# EAGLE design dash-board2 (EAGLE 4.16)
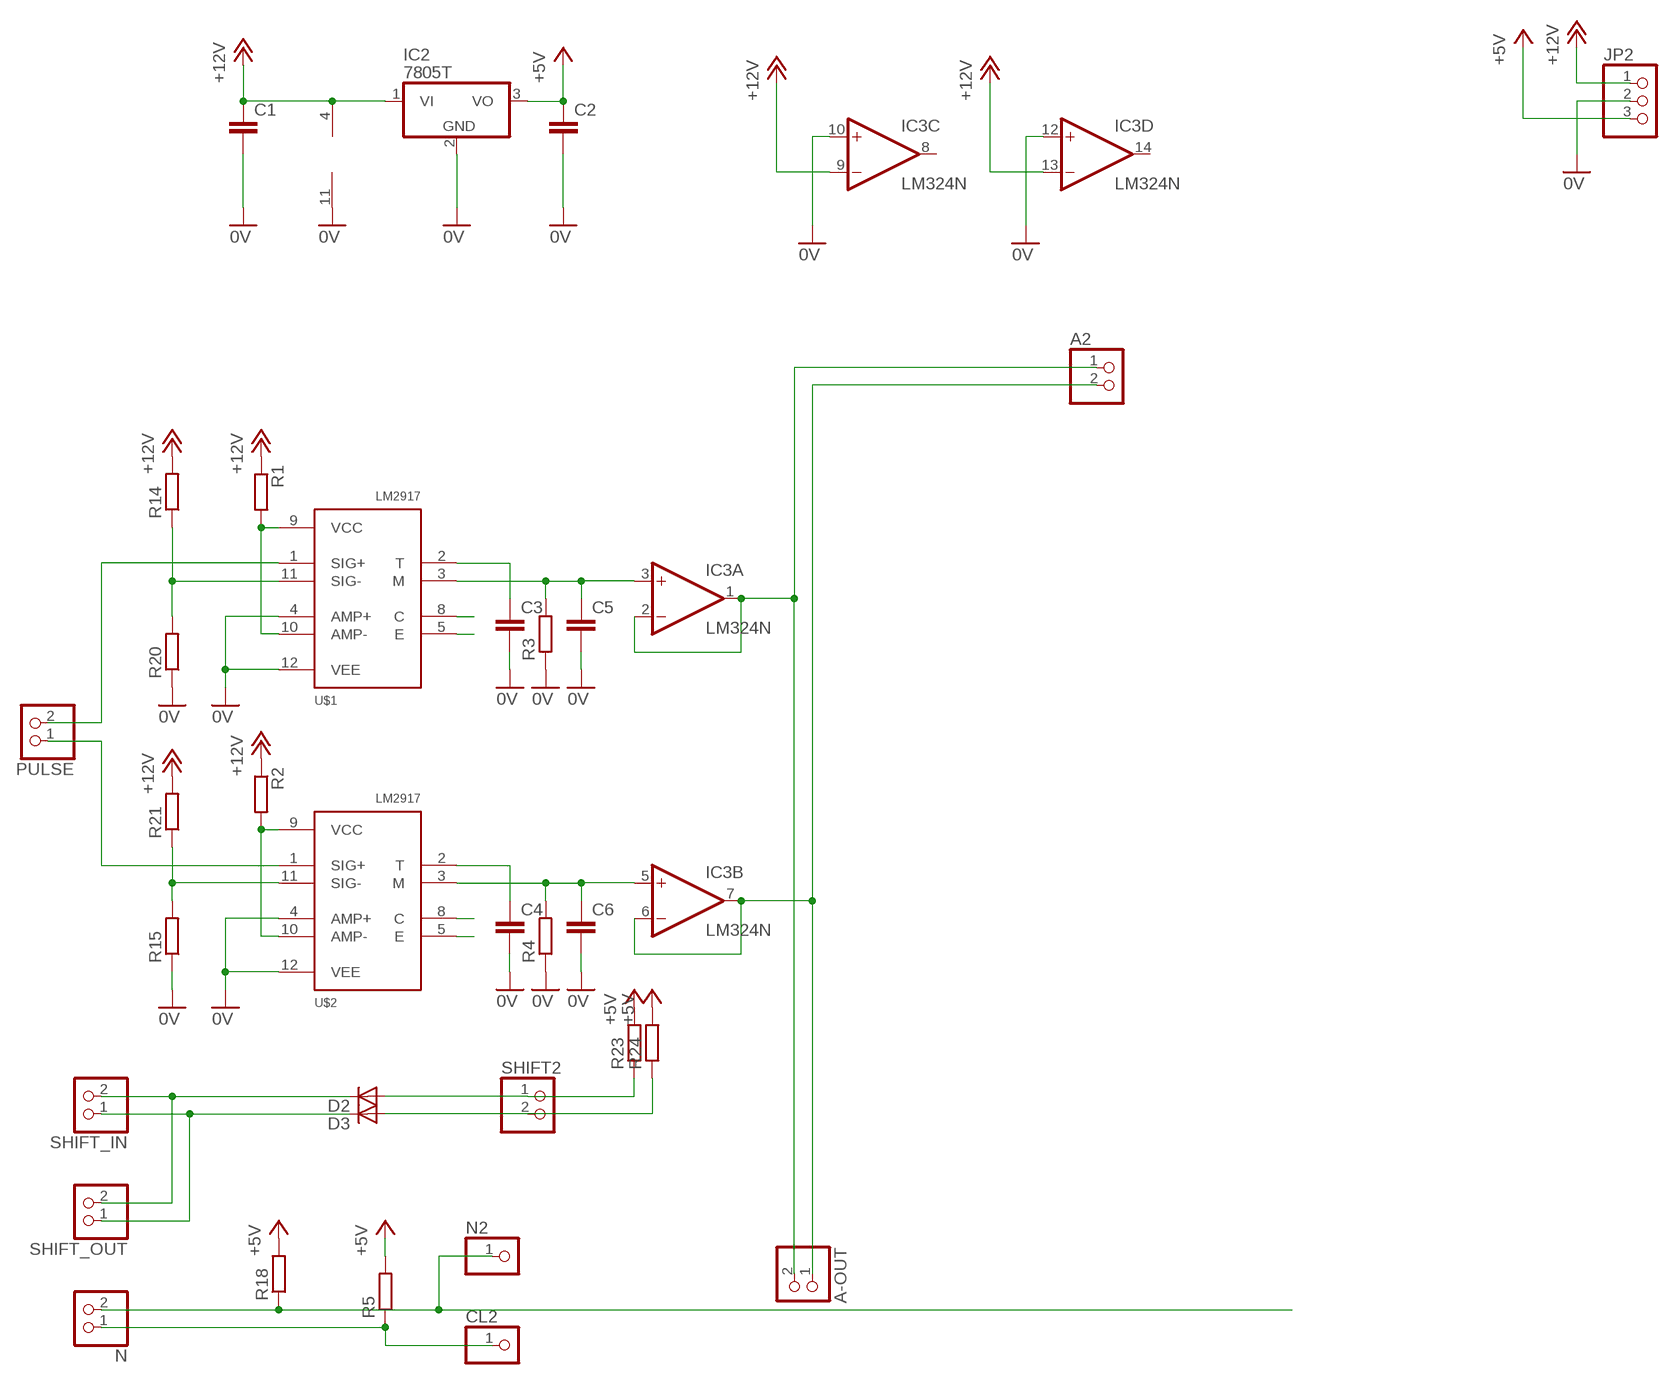
[diagram p0: schematic, sheet 1]

## Parts
A2  PINHD-1X2  [1X02]
A-OUT  PINHD-1X2  [1X02]
C1  C-EU050-025X075  [C050-025X075]
C2  C-EU050-025X075  [C050-025X075]
C3  C-EU050-025X075  [C050-025X075]
C4  C-EU050-025X075  [C050-025X075]
C5  C-EU050-025X075  [C050-025X075]
C6  C-EU050-025X075  [C050-025X075]
CL2  PINHD-1X1  [1X01]
D2  DIODE-D-7.5  [D-7.5]
D3  DIODE-D-7.5  [D-7.5]
IC2  7805T  [TO220H]
IC3  LM324N  [DIL14]
JP2  PINHD-1X3  [1X03]
N  PINHD-1X2  [1X02]
N2  PINHD-1X1  [1X01]
PULSE  PINHD-1X2  [1X02]
R1  R-EU_0204/7  [0204/7]
R2  R-EU_0204/7  [0204/7]
R3  R-EU_0204/7  [0204/7]
R4  R-EU_0204/7  [0204/7]
R5  R-EU_0204/7  [0204/7]
R14  R-EU_0204/7  [0204/7]
R15  R-EU_0204/7  [0204/7]
R18  R-EU_0204/7  [0204/7]
R20  R-EU_0204/7  [0204/7]
R21  R-EU_0204/7  [0204/7]
R23  R-EU_0204/7  [0204/7]
R24  R-EU_0204/7  [0204/7]
SHIFT2  PINHD-1X2  [1X02]
SHIFT_IN  PINHD-1X2  [1X02]
SHIFT_OUT  PINHD-1X2  [1X02]
U$1  LM2917  [DIL14]
U$2  LM2917  [DIL14]

## Nets
0V: C1.2 C2.2 C3.2 C4.2 C5.2 C6.2 IC2.2(GND) IC3.10(C:+IN) IC3.11(P:V-) IC3.12(D:+IN) JP2.2 R3.1 R4.1 R15.1 R20.1 U$1.4(AMP+) U$1.12(VEE) U$2.4(AMP+) U$2.12(VEE)
+5V: C2.1 IC2.3(VO) JP2.3 R5.2 R18.2 R23.2 R24.2
+12V: C1.1 IC2.1(VI) IC3.4(P:V+) IC3.9(C:-IN) IC3.13(D:-IN) JP2.1 R1.1 R2.1 R14.2 R21.2
N$1: PULSE.2 U$1.1(SIG+)
N$2: R1.2 U$1.9(VCC) U$1.10(AMP-)
N$3: R2.2 U$2.9(VCC) U$2.10(AMP-)
N$8: CL2.1 N.1 R5.1
N$14: C3.1 U$1.2(T)
N$15: C4.1 U$2.2(T)
N$16: C6.1 IC3.5(B:+IN) R4.2 U$2.3(M)
N$17: C5.1 IC3.3(A:+IN) R3.2 U$1.3(M)
N$19: PULSE.1 U$2.1(SIG+)
N$23: U$1.8(C)
N$37: A2.1 A-OUT.2 IC3.1(A:OUT) IC3.2(A:-IN)
N$38: A2.2 A-OUT.1 IC3.6(B:-IN) IC3.7(B:OUT)
N$39: D2.C SHIFT_IN.2 SHIFT_OUT.2
N$40: D3.A R24.1 SHIFT2.2
N$42: R14.1 R20.2 U$1.11(SIG-)
N$47: N2.1 N.2 R18.1
N$50: U$2.8(C)
N$51: U$2.5(E)
N$52: U$1.5(E)
N$53: R15.2 R21.1 U$2.11(SIG-)
N$65: D2.A R23.1 SHIFT2.1
N$67: D3.C SHIFT_IN.1 SHIFT_OUT.1
Unconnected: IC3.8(C:OUT) IC3.14(D:OUT)

## Library data of the parts
A2 A-OUT N PULSE SHIFT2 SHIFT_IN SHIFT_OUT = pinhead:PINHD-1X2: PIN HEADER
C1-C6 = rcl:C-EU: CAPACITOR, European symbol
CL2 N2 = pinhead:PINHD-1X1: PIN HEADER
D2 D3 = diode:DIODE-: DIODE
IC2 = linear:78*: Positive VOLTAGE REGULATOR Source: http://cache.national.com/ds/LM/LM78L05.pdf http://www.fairchildsemi.com/ds/LM/LM7805.pdf
IC3 = linear:LM324: OP AMP
JP2 = pinhead:PINHD-1X3: PIN HEADER
R1-R5 R14 R15 R18 R20 R21 R23 R24 = rcl:R-EU_: RESISTOR, European symbol
U$1 U$2 = rnie04:LM2917

## Board
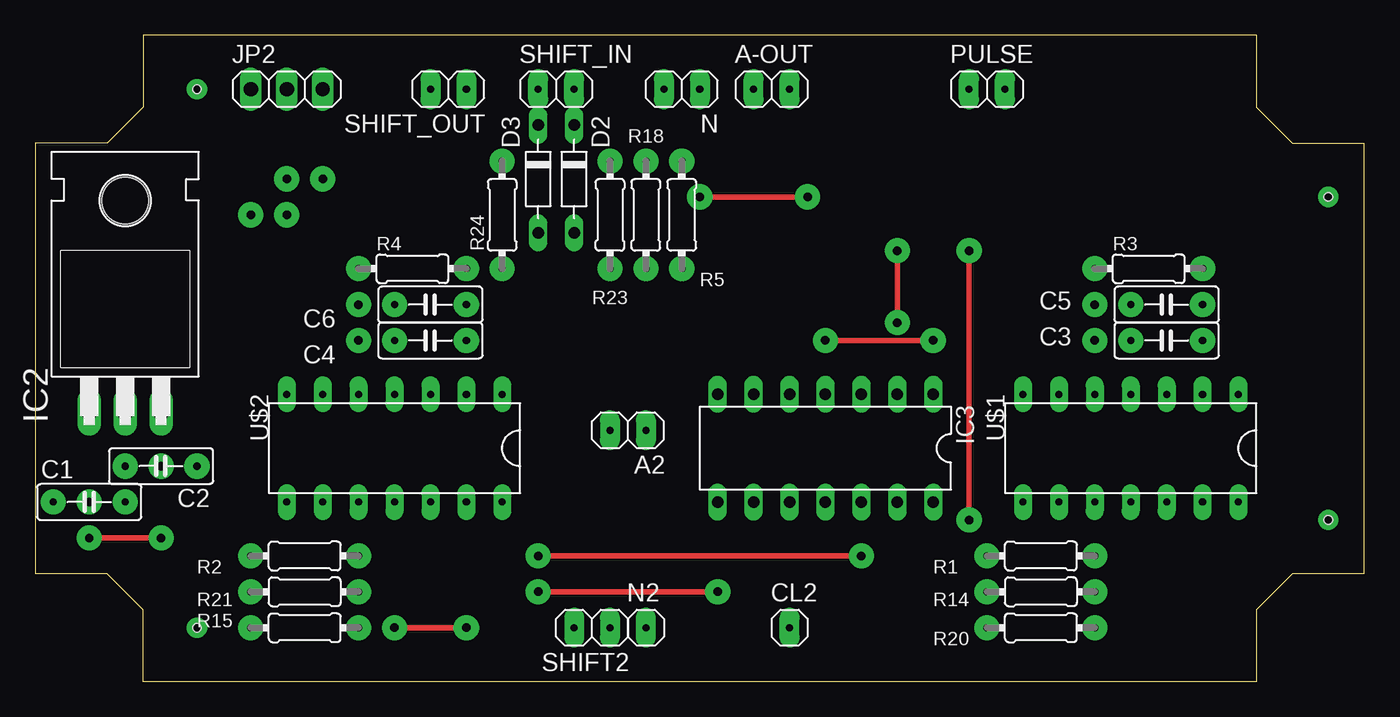
[diagram p1: board, top side]
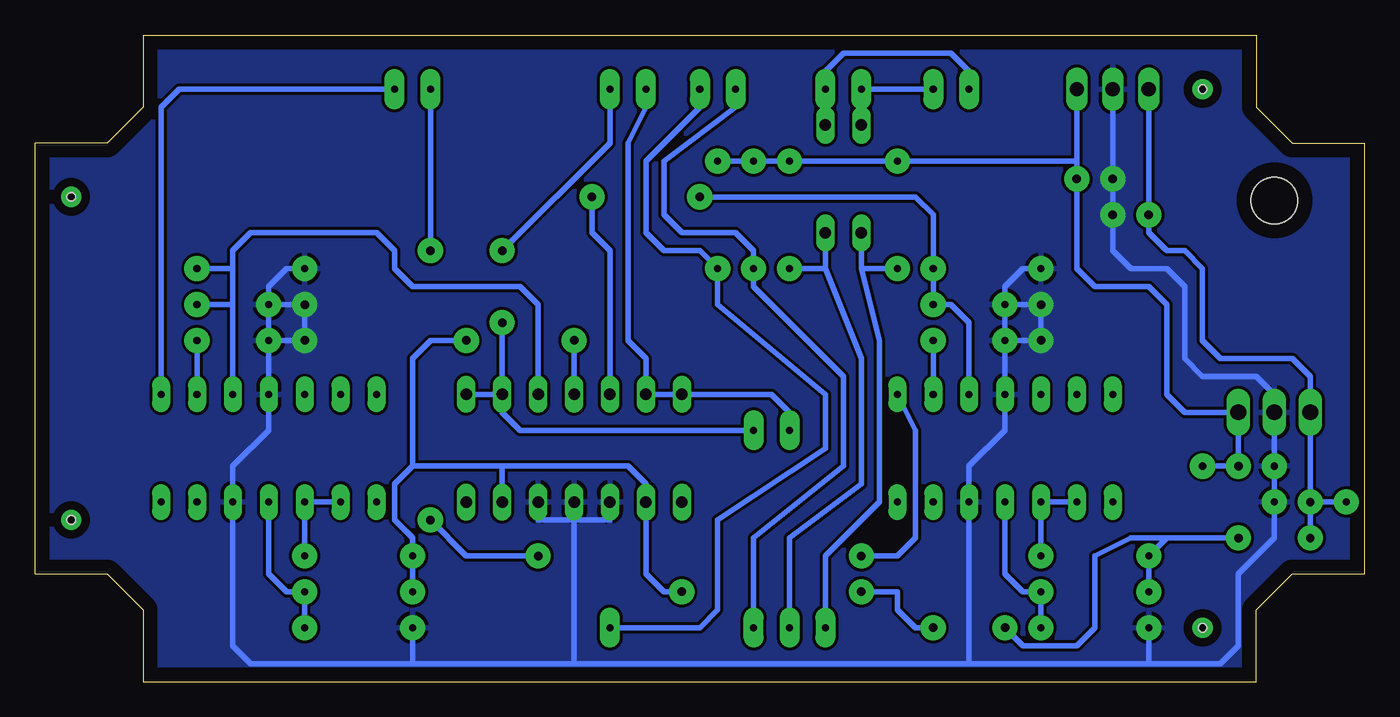
[diagram p2: board, bottom side, seen from below]

Size 93.98 x 45.72 mm. Coordinates in mm from the lower left corner, seen from the top.
Outline: 93.98,7.62 93.98,38.1 88.9,38.1 86.36,40.64 86.36,45.72 7.62,45.72 7.62,40.64 5.08,38.1 0,38.1 0,7.62 5.08,7.62 7.62,5.08 7.62,0 86.36,0 86.36,5.08 88.9,7.62 93.98,7.62
Copper layers (1*16): Top 0.035mm / dielectric 1.5mm / Bottom 0.035mm
Design rules "default": minimum track width 10mil, minimum drill 24mil, track to track 8mil, track to pad 8mil, pad to pad 8mil, via to via 8mil, smd to smd 8mil, copper to edge 40mil, drill to drill 8mil, minimum pad ring 10mil, minimum via ring 8mil, stop-mask expansion 4mil, vias tented up to drill 0mil, thermal gap 10mil
Holes 0.6 mm at 11.43,3.81 11.43,41.91 91.44,34.29 91.44,11.43

### Footprints (pad centres in the part's own frame; a part is rotated, then mirrored left to right if it is on the bottom)
1X02 = drill 0.5 pad 1.422 long: 1 -1.27,0; 2 1.27,0
C050-025X075 = drill 0.5 pad 1.778 round: 1 -2.54,0; 2 2.54,0
1X01 = drill 0.5 pad 1.422 long: 1 0,0
D-7.5 = drill 0.813 long: A 3.81,0; C -3.81,0
TO220H = drill 1.118 long: 1 -2.54,-10.16; 2 0,-10.16; 3 2.54,-10.16 | hole 3.302: 0,4.826
DIL14 = drill 0.813 long: 1 -7.62,-3.81; 2 -5.08,-3.81; 3 -2.54,-3.81; 4 0,-3.81; 5 2.54,-3.81; 6 5.08,-3.81; 7 7.62,-3.81; 8 7.62,3.81; 9 5.08,3.81; 10 2.54,3.81; 11 0,3.81; 12 -2.54,3.81; 13 -5.08,3.81; 14 -7.62,3.81
1X03 = drill 1.016 long: 1 -2.54,0; 2 0,0; 3 2.54,0
0204/7 = drill 0.5 pad 1.778 round: 1 -3.81,0; 2 3.81,0
DIL14' = drill 0.5 pad 1.27 long: 1 -3.81,7.62; 2 -3.81,5.08; 3 -3.81,2.54; 4 -3.81,0; 5 -3.81,-2.54; 6 -3.81,-5.08; 7 -3.81,-7.62; 8 3.81,-7.62; 9 3.81,-5.08; 10 3.81,-2.54; 11 3.81,0; 12 3.81,2.54; 13 3.81,5.08; 14 3.81,7.62

### Placement (x,y rotation side)
A2  41.91,17.78 180 top
A-OUT  52.07,41.91 0 top
C1  3.81,12.7 0 top
C2  8.89,15.24 180 top
C3  80.01,24.13 180 top
C4  27.94,24.13 180 top
C5  80.01,26.67 180 top
C6  27.94,26.67 180 top
CL2  53.34,3.81 0 top
D2  38.1,35.56 270 top
D3  35.56,35.56 270 top
IC2  6.35,29.21 0 top
IC3  55.88,16.51 180 top
JP2  17.78,41.91 0 top
N  45.72,41.91 180 top
N2  43.18,3.81 0 top
PULSE  67.31,41.91 0 top
R1  71.12,8.89 0 top
R2  19.05,8.89 0 top
R3  78.74,29.21 0 top
R4  26.67,29.21 0 top
R5  45.72,33.02 90 top
R14  71.12,6.35 180 top
R15  19.05,3.81 0 top
R18  43.18,33.02 90 top
R20  71.12,3.81 0 top
R21  19.05,6.35 180 top
R23  40.64,33.02 90 top
R24  33.02,33.02 90 top
SHIFT2  39.37,3.81 180 top
SHIFT_IN  36.83,41.91 0 top
SHIFT_OUT  29.21,41.91 180 top
U$1  LM2917  [DIL14']  77.47,16.51 270 top
U$2  LM2917  [DIL14']  25.4,16.51 270 top

### Tracks (layer width: path | path; a pad name or v marks a point on that pad's centre or on a via)
0V  (via drill 0.6 pad 1.78)
  Bottom 0.406: C4.2 U$2.4 25.4,17.78 27.94,15.24 U$2.12 27.94,1.27 | C3.2 U$1.4 77.47,17.78 80.01,15.24 U$1.12 80.01,2.54 78.74,1.27 67.31,1.27 | C5.2 77.47,27.94 76.2,29.21 R3.1 | C3.2 C5.2 | C4.2 C6.2 | C6.2 25.4,27.94 24.13,29.21 R4.1 | JP2.2 v17.78,35.56 v17.78,33.02 17.78,30.48 16.51,29.21 13.97,29.21 12.7,27.94 12.7,22.86 11.43,21.59 7.62,21.59 6.35,20.32 IC2.2 C2.2 C1.2 6.35,10.16 8.89,7.62 8.89,2.54 10.16,1.27 15.24,1.27 | 55.88,1.27 55.88,11.43 | 55.88,11.43 IC3.11 | 15.24,1.27 27.94,1.27 | 27.94,1.27 55.88,1.27 | 55.88,1.27 67.31,1.27 | IC3.12 58.42,11.43 55.88,11.43 | IC3.10 53.34,11.43 55.88,11.43 | 67.31,1.27 R20.1 | 15.24,1.27 R15.1 | C4.2 v22.86,24.13 v22.86,26.67 C6.2 | C3.2 v74.93,24.13 v74.93,26.67 C5.2
  pour Bottom: 0,45.72 0,0 93.98,0 93.98,45.72
+5V  (via drill 0.6 pad 1.78)
  Bottom 0.406: 20.32,36.83 JP2.3 | 20.32,36.83 v20.32,35.56 20.32,29.21 19.05,27.94 15.24,27.94 13.97,26.67 13.97,20.32 12.7,19.05 IC2.3 v8.89,15.24 C2.1 | 20.32,36.83 R24.2 R23.2 R18.2 R5.2
+12V  (via drill 0.6 pad 1.78)
  Top 0.406: v3.81,10.16 v8.89,10.16 | v25.4,3.81 v30.48,3.81 | v35.56,6.35 v48.26,6.35 | v63.5,24.13 v55.88,24.13
  Bottom 0.406: JP2.1 v15.24,33.02 15.24,31.75 13.97,30.48 12.7,30.48 11.43,29.21 11.43,24.13 10.16,22.86 5.08,22.86 3.81,21.59 IC2.1 v3.81,12.7 | C1.1 v3.81,12.7 | R14.2 R1.1 67.31,10.16 68.58,11.43 68.58,13.97 67.31,15.24 | R21.2 R2.1 13.97,10.16 | 60.96,15.24 52.07,15.24 50.8,13.97 IC3.9 50.8,7.62 49.53,6.35 v48.26,6.35 | v8.89,10.16 13.97,10.16 | v3.81,12.7 v3.81,10.16 | 13.97,10.16 16.51,10.16 19.05,8.89 19.05,3.81 20.32,2.54 24.13,2.54 v25.4,3.81 | v30.48,3.81 31.75,3.81 33.02,5.08 33.02,6.35 v35.56,6.35 | 60.96,15.24 IC3.13 | 60.96,15.24 67.31,15.24 | 67.31,15.24 67.31,22.86 66.04,24.13 v63.5,24.13 | v55.88,24.13 IC3.4
N$1
  Bottom 0.406: U$1.1 85.09,40.64 83.82,41.91 PULSE.2
N$2
  Bottom 0.406: U$1.10 U$1.9 U$1.10 | R1.2 U$1.10
N$3
  Bottom 0.406: U$2.10 U$2.9 U$2.10 | R2.2 U$2.10
N$4  (via drill 0.6 pad 1.42)
  other vias: 11.43,3.81
N$5  (via drill 0.6 pad 1.42)
  other vias: 11.43,41.91
N$6  (via drill 0.6 pad 1.42)
  other vias: 91.44,34.29
N$7  (via drill 0.6 pad 1.42)
  other vias: 91.44,11.43
N$8
  Bottom 0.406: CL2.1 46.99,3.81 45.72,5.08 45.72,11.43 38.1,16.51 38.1,20.32 45.72,26.67 R5.1 46.99,30.48 49.53,30.48 50.8,31.75 50.8,36.83 46.99,40.64 N.1
N$14
  Bottom 0.406: U$1.2 C3.1
N$15
  Bottom 0.406: U$2.2 C4.1
N$16  (via drill 0.6 pad 1.78)
  Top 0.406: v46.99,34.29 v54.61,34.29
  Bottom 0.406: C6.1 R4.2 | U$2.3 27.94,25.4 29.21,26.67 C6.1 | C6.1 30.48,33.02 31.75,34.29 v46.99,34.29 | v54.61,34.29 54.61,31.75 53.34,30.48 IC3.5
N$17
  Bottom 0.406: 80.01,26.67 U$1.3 | 80.01,26.67 C5.1 | IC3.3 58.42,26.67 59.69,27.94 67.31,27.94 68.58,29.21 68.58,30.48 69.85,31.75 78.74,31.75 80.01,30.48 80.01,29.21 | 80.01,29.21 80.01,26.67 | 80.01,29.21 R3.2
N$19  (via drill 0.6 pad 1.78)
  Top 0.406: v66.04,11.43 v66.04,30.48 | v35.56,8.89 v58.42,8.89
  Bottom 0.406: v66.04,30.48 PULSE.1 | v66.04,11.43 63.5,8.89 v58.42,8.89 | v35.56,8.89 33.02,8.89 31.75,10.16 31.75,17.78 U$2.1
N$37  (via drill 0.6 pad 1.78)
  Top 0.406: v60.96,25.4 v60.96,30.48
  Bottom 0.406: IC3.2 IC3.1 | A2.1 59.69,17.78 60.96,19.05 IC3.2 | v60.96,30.48 53.34,38.1 A-OUT.2 | IC3.2 v60.96,25.4
N$38
  Bottom 0.406: 46.99,20.32 IC3.7 IC3.6 | A2.2 40.64,19.05 41.91,20.32 46.99,20.32 | 46.99,20.32 IC3.6 | IC3.6 50.8,22.86 52.07,24.13 52.07,38.1 50.8,40.64 A-OUT.1
N$39
  Bottom 0.406: D2.C SHIFT_IN.2 38.1,43.18 36.83,44.45 29.21,44.45 27.94,43.18 SHIFT_OUT.2
N$40
  Bottom 0.406: SHIFT2.2 38.1,8.89 34.29,12.7 34.29,24.13 35.56,29.21 | 35.56,29.21 R24.1 | 35.56,29.21 D3.A
N$42
  Bottom 0.406: U$1.11 77.47,7.62 76.2,6.35 R14.1 R20.2
N$47
  Bottom 0.406: N2.1 43.18,10.16 36.83,15.24 36.83,21.59 43.18,27.94 R18.1 43.18,30.48 44.45,31.75 48.26,31.75 49.53,33.02 49.53,36.83 44.45,40.64 N.2
N$53
  Bottom 0.406: R15.2 R21.1 24.13,6.35 25.4,7.62 U$2.11
N$65
  Bottom 0.406: SHIFT2.1 40.64,10.16 35.56,13.97 35.56,22.86 38.1,29.21 | 38.1,29.21 R23.1 | 38.1,29.21 D2.A
N$67
  Bottom 0.406: SHIFT_OUT.1 SHIFT_IN.1 D3.C